# Altium schematic sheet Communication.SchDoc: Communication.SchDoc
size A4; Author: Daniel Sinko; Revision: A; SheetNumber: 4; SheetTotal: 5
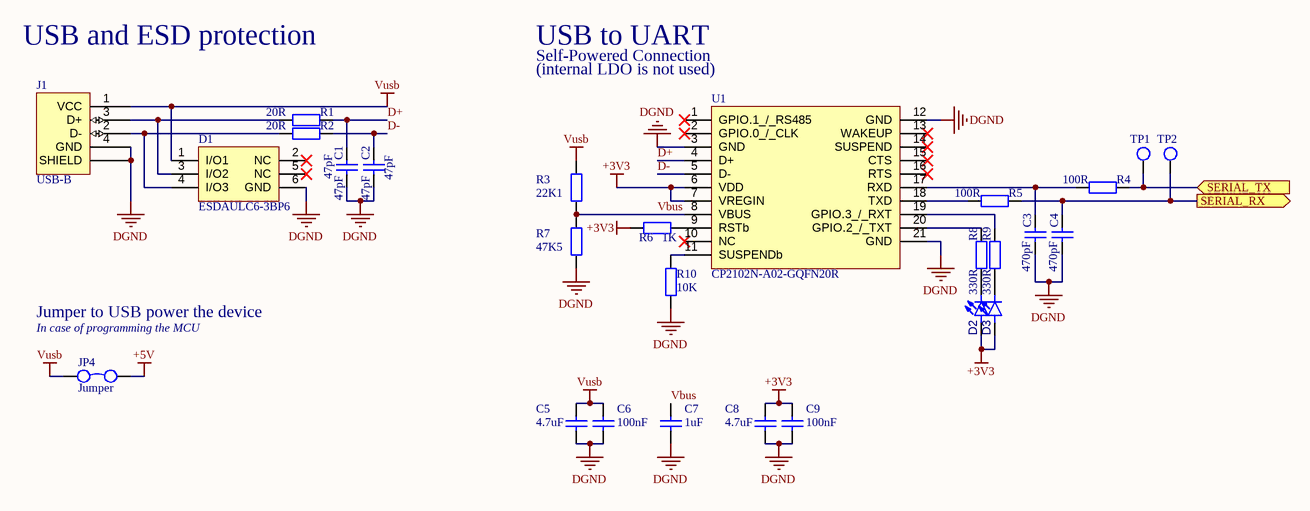
[diagram p0: Communication.SchDoc]

## Parts
C1  47pF  [CAP0603]
C2  47pF  [CAP0603]
C3  470pF  [CAP0603]
C4  470pF  [CAP0603]
C5  4.7uF  [CAP0603]
C6  100nF  [CAP0603]
C7  1uF  [CAP0603]
C8  4.7uF  [CAP0603]
C9  100nF  [CAP0603]
D1  ESDAULC6-3BP6  [SOT-666]
D2  (no value)  [LED0603]
D3  (no value)  [LED0603]
J1  USB-B  [USB-B-FEMALE]
JP4  Jumper  [PIN-1X2]
R1  20R  [RES0603]
R2  20R  [RES0603]
R3  22K1  [RES0603]
R4  100R  [RES0603]
R5  100R  [RES0603]
R6  1K  [RES0603]
R7  47K5  [RES0603]
R8  330R  [RES0603]
R9  330R  [RES0603]
R10  10K  [RES0603]
TP1  Test Point  [TP-1.5HOLE]  (value not drawn)
TP2  Test Point  [TP-1.5HOLE]  (value not drawn)
U1  CP2102N-A02-GQFN20R  [QFN-20]

## Ports
SERIAL_RX (out, see Main[4C], uC[1B]), SERIAL_TX (in, see Main[4C], uC[1B])

## Nets
+3V3: C8.2 C9.1 D2.2(A) D3.2(A) R6.1 U1.6(VDD) U1.7(VREGIN)
+5V: JP4.2
DGND: C1.1 C2.1 C3.1 C4.1 C5.1 C6.2 C7.1 C8.1 C9.2 D1.6(GND) J1.0(SHIELD) J1.4(GND) R7.1 R10.1 U1.3(GND) U1.12(GND) U1.21(GND)
Vusb: C5.2 C6.1 D1.1(I/O1) J1.1(VCC) JP4.1 R3.2
D+: C1.2 R1.1 U1.4(D+)
D-: C2.2 R2.1 U1.5(D-)
SERIAL_RX: C4.2 R5.2 TP2.1 ; port SERIAL_RX
SERIAL_TX: R4.2 TP1.1 ; port SERIAL_TX
Vbus: C7.2 R3.1 R7.2 U1.8(VBUS)
NetC3_2: C3.2 R4.1 U1.17(RXD)
NetD1_3: D1.3(I/O2) J1.3(D+) R1.2
NetD1_4: D1.4(I/O3) J1.2(D-) R2.2
NetD2_1: D2.1(K) R8.2
NetD3_1: D3.1(K) R9.2
NetR5_1: R5.1 U1.18(TXD)
NetR6_2: R6.2 U1.9(RSTb)
NetR8_1: R8.1 U1.20(GPIO.2_/_TXT)
NetR9_1: R9.1 U1.19(GPIO.3_/_RXT)
NetR10_2: R10.2 U1.11(SUSPENDb)

Not connected (* = marked no-connect by the designer): D1 2(NC)* 5(NC)*; U1 1(GPIO.1_/_RS485)* 2(GPIO.0_/_CLK)* 10(NC)* 13(WAKEUP)* 14(SUSPEND)* 15(CTS)* 16(RTS)*

## Notes on the sheet
- USB and ESD protection
- USB to UART
- Self-Powered Connection
- (near U1) (internal LDO is not used)
- Jumper to USB power the device
- (near JP4) In case of programming the MCU
- Size
- Date
- A4
- Title
- Sheet number
- Author
- Revision

## Library data of the parts
C1 C2 = 47pF: Ceramic Capacitor, Multilayer, Ceramic, 100V, 5% +Tol, 5% -Tol, C0G, 30ppm/Cel TC, 0.000047uF, Surface Mount, 0603; Manufacturer: KEMET; Manufacturer Part Number: C0603C470J1GACTU; Multilayer: Yes; Voltage: *; Supplier: Mouser; Supplier Part Number: 80-C0603C470J1G; RoHS: Yes; Category: Ceramic Capacitors; Stock: 43381; Pricing: 1=0.1, 10=0.026, 50=0.026, 100=0.016, 1000=0.012, 10000=0.007 (USD); Mounting Technology: Surface Mount; Pins: 2; Dielectric Material: Ceramic; Package Shape: Rectangular; Case/Package: 0603; Terminal Finish: Nickel; Min Operating Temperature: -55°C; Max Operating Temperature: 125°C; JESD-609 Code: e3; Capacitor Type: Ceramic; Tolerance  (fill in as +-): 5%; Package Style: SMTMeter; Packaging: Tape and Reel; Tolerance (fill in as +-): 5%; Rated DC Voltage (URdc): 100V; Temperature Characteristics Code: C0G; Termination: Wraparound; Length: 1.6mm; Width: 0.8mm; Height: 0.8mm; Reach SVHC Compliant: Yes; RoHS Compliant: Yes; ComponentLink1URL: https://datasheet.ciiva.com:443/pdfs/VipMasterIC/IC/KEME/KEME-S-A0005605168/KEME-S-A0005605168-1.pdf?src-supplier=IHS+Markit; ComponentLink1Description: https://datasheet.ciiva.com:443/pdfs/VipMasterIC/IC/KEME/KEME-S-A0005605168/KEME-S-A0005605168-1.pdf?src-supplier=IHS+Markit; ComponentLink2URL: https://datasheet.ciiva.com/28668/1789732-28668693.pdf?src-supplier=Element14; ComponentLink2Description: https://datasheet.ciiva.com/28668/1789732-28668693.pdf?src-supplier=Element14; ComponentLink3URL: https://datasheet.ciiva.com/18193/getdatasheetpartid-544691-18193046.pdf?src-supplier=Verical; ComponentLink3Description: https://datasheet.ciiva.com/18193/getdatasheetpartid-544691-18193046.pdf?src-supplier=Verical; ComponentLink4URL: https://datasheet.ciiva.com/18101/getdatasheetpartid-38001-18101098.pdf?src-supplier=Verical; ComponentLink4Description: https://datasheet.ciiva.com/18101/getdatasheetpartid-38001-18101098.pdf?src-supplier=Verical; Value: 47pF
C3 C4 = 470pF: Ceramic Capacitor, Multilayer, Ceramic, 250V, 5% +Tol, 5% -Tol, C0G, 30ppm/Cel TC, 0.00047uF, Surface Mount, 0603; Manufacturer: KEMET; Manufacturer Part Number: C0603C471JAGACAUTO; Multilayer: Yes; Reference Standard: AEC-Q200; Supplier: Mouser; Supplier Part Number: 80-C0603C471JAGAUTO; RoHS: Yes; Category: Ceramic Capacitors; Stock: 51887; Pricing: 1=0.1, 10=0.068, 50=0.068, 100=0.034, 1000=0.022, 10000=0.017 (USD); Pins: 2; Dielectric Material: Ceramic; Case/Package: 0603; Terminal Finish: Nickel; Min Operating Temperature: -55°C; Max Operating Temperature: 125°C; JESD-609 Code: e3; Capacitor Type: Ceramic; Tolerance  (fill in as +-): 5%; Package Style: SMTMeter; Packaging: Tape and Reel; Tolerance (fill in as +-): 5%; Rated DC Voltage (URdc): 250V; Temperature Characteristics Code: C0G; Length: 1.6mm; Width: 0.8mm; Height: 0.8mm; Reach SVHC Compliant: Yes; RoHS Compliant: Yes; ComponentLink1URL: https://datasheet.ciiva.com:443/pdfs/VipMasterIC/IC/KEME/KEME-S-A0008958445/KEME-S-A0008958445-1.pdf?src-supplier=IHS+Markit; ComponentLink1Description: https://datasheet.ciiva.com:443/pdfs/VipMasterIC/IC/KEME/KEME-S-A0008958445/KEME-S-A0008958445-1.pdf?src-supplier=IHS+Markit; ComponentLink2URL: http://www.mouser.com/ds/2/212/KEM_C1086_U2J-962528.pdf?src-supplier=Mouser; ComponentLink2Description: http://www.mouser.com/ds/2/212/KEM_C1086_U2J-962528.pdf?src-supplier=Mouser; ComponentLink3URL: http://www.kemet.com/Lists/ProductCatalog/Attachments/420/KEM_C1022_C0G_AUTO_SMD.pdf?src-supplier=Digikey; ComponentLink3Description: http://www.kemet.com/Lists/ProductCatalog/Attachments/420/KEM_C1022_C0G_AUTO_SMD.pdf?src-supplier=Digikey; ComponentLink4URL: https://api.kemet.com/component-edge/download/datasheet/C0603C471JAGACAUTO.pdf?src-supplier=Digikey; ComponentLink4Description: https://api.kemet.com/component-edge/download/datasheet/C0603C471JAGACAUTO.pdf?src-supplier=Digikey; Value: 470pF
C5 C8 = 4.7uF: Capacitor Ceramic 4.7uF 10V X5R 10% 0603 T/R; Manufacturer: Samsung; Manufacturer Part Number: CL10A475KP8NNWC; Voltage: *; Value: 4.7uF; Supplier: Mouser; Supplier Part Number: 187-CL10A475KP8NNWC; RoHS: No; Category: Ceramic Capacitors; Stock: 20365; Pricing: 1=0.1, 10=0.024, 50=0.024, 100=0.021, 1000=0.012, 10000=0.009 (USD)
C6 C9 = 100nF: Ceramic Capacitor, Multilayer, Ceramic, 25V, 10% +Tol, 10% -Tol, X7R, 15% TC, 0.1uF, Surface Mount, 0603; Manufacturer: Samsung; Manufacturer Part Number: CL10B104KA8WPNC; Multilayer: Yes; Reference Standard: AEC-Q200; Voltage: *; Value: 100nF; Supplier: Mouser; Supplier Part Number: 187-CL10B104KA8WPNC; RoHS: Yes; Category: Ceramic Capacitors; Stock: 62899; Pricing: 1=0.1, 10=0.026, 50=0.026, 100=0.018, 1000=0.014, 10000=0.009 (USD); Mounting Technology: Surface Mount; Pins: 2; Dielectric Material: Ceramic; Package Shape: Rectangular; Case/Package: 0603; Terminal Finish: Nickel; Min Operating Temperature: -55°C; Max Operating Temperature: 125°C; JESD-609 Code: e3; Capacitor Type: Ceramic; Tolerance  (fill in as +-): 10%; Packaging: Tape and Reel; Tolerance (fill in as +-): 10%; Rated DC Voltage (URdc): 25V; Temperature Characteristics Code: X7R; Termination: Wraparound; Reach SVHC Compliant: Yes; RoHS Compliant: Yes; ComponentLink1URL: https://datasheet.ciiva.com:443/pdfs/VipMasterIC/IC/SEMS/SEMS-S-A0005596039/SEMS-S-A0005592818-1.pdf?src-supplier=IHS+Markit; ComponentLink1Description: https://datasheet.ciiva.com:443/pdfs/VipMasterIC/IC/SEMS/SEMS-S-A0005596039/SEMS-S-A0005592818-1.pdf?src-supplier=IHS+Markit; ComponentLink2URL: http://www.samsungsem.com/kr/support/library/product-catalog/mlcc.jsp?src-supplier=Digikey; ComponentLink2Description: http://www.samsungsem.com/kr/support/library/product-catalog/mlcc.jsp?src-supplier=Digikey; ComponentLink3URL: http://www.samsungsem.com/kr/support/product-search/mlcc/CL10B104KA8WPNC.jsp?src-supplier=Digikey; ComponentLink3Description: http://www.samsungsem.com/kr/support/product-search/mlcc/CL10B104KA8WPNC.jsp?src-supplier=Digikey; ComponentLink4URL: http://www.samsungsem.com/servlet/FileDownload?filename=productcatalog/pdf/MLCC.pdf&src-supplier=Avnet; ComponentLink4Description: http://www.samsungsem.com/servlet/FileDownload?filename=productcatalog/pdf/MLCC.pdf&src-supplier=Avnet; ComponentLink5URL: https://datasheet.octopart.com/CL10B104KA8WPNC-Samsung-Electro-Mechanics-datasheet-148763375.pdf?src-supplier=Future+Electronics; ComponentLink5Description: https://datasheet.octopart.com/CL10B104KA8WPNC-Samsung-Electro-Mechanics-datasheet-148763375.pdf?src-supplier=Future+Electronics; ComponentLink6URL: https://datasheet.octopart.com/CL10B104KA8WPNC-Samsung-datasheet-8326407.pdf?src-supplier=TME; ComponentLink6Description: https://datasheet.octopart.com/CL10B104KA8WPNC-Samsung-datasheet-8326407.pdf?src-supplier=TME
C7 = 1uF: Ceramic Capacitor, Multilayer, Ceramic, 16V, 10% +Tol, 10% -Tol, X7R, 15% TC, 1uF, Surface Mount, 0603; Manufacturer: Walsin Technologies; Manufacturer Part Number: SH18B105K160CT; Voltage: *; Value: 1uF; Supplier: Mouser; Supplier Part Number: 791-SH18B105K160CT; RoHS: Yes; Category: Ceramic Capacitors; Stock: 5174; Pricing: 1=0.1, 10=0.04, 50=0.04, 100=0.023, 1000=0.015, 10000=0.01 (USD); ComponentLink1URL: https://datasheet.octopart.com/SH18B105K160CT-Walsin-Technologies-datasheet-149178370.pdf?src-supplier=TECHDesign; ComponentLink1Description: https://datasheet.octopart.com/SH18B105K160CT-Walsin-Technologies-datasheet-149178370.pdf?src-supplier=TECHDesign
D1 = ESDAULC6-3BP6: Trans Voltage Suppressor Diode, Bidirectional, 4 Element, Silicon; Manufacturer_Name: STMicroelectronics; Package Body Material: Plastic; Max Breakdown Voltage: 9.2V; Min Breakdown Voltage: 6V; Breakdown Voltage-Nom: 7.6V; Number of Elements: 4; Time @ Peak Reflow Temperature-Max (s): 30s; Qualification Status: Not Qualified; Datasheet Link: https://www.st.com/resource/en/datasheet/esdaulc6-3bp6.pdf; Height: 0.6mm; Manufacturer_Part_Number: ESDAULC6-3BP6; Mouser Part Number: 511-ESDAULC63BP6; Mouser Price/Stock: https://www.mouser.co.uk/ProductDetail/STMicroelectronics/ESDAULC6-3BP6?qs=eU2TTeT5rM3P6hIT2KJeMw%3D%3D; Arrow Part Number: ESDAULC6-3BP6; Arrow Price/Stock: https://www.arrow.com/en/products/esdaulc6-3bp6/stmicroelectronics?region=europe; Supplier: Mouser; Supplier Part Number: 511-ESDAULC63BP6; Manufacturer: STMicroelectronics; Manufacturer Part Number: ESDAULC6-3BP6; RoHS: Yes; Category: TVS Diodes; Stock: 6079; Pricing: 1=0.46, 10=0.312, 50=0.312, 100=0.211, 1000=0.146, 10000=0.103 (USD); Pins: 6; Diode Element Material: SILICON; Package Shape: Rectangular; Terminal Finish: Tin; Max Operating Temperature: 150°C; JESD-609 Code: e3; Polarity: Bidirectional; Diode Type: TRANS VOLTAGE SUPPRESSOR; JESD-30 Code: R-PDSO-F6; Moisture Sensitivity Level: 1; Package Style: SMALL OUTLINEMeter; Peak Reflow Temperature (Cel): 260°C; Surface Mount: Yes; Technology: AVALANCHE; Terminal Form: Flat; Terminal Position: DUAL; Reach SVHC Compliant: Yes; RoHS Compliant: Yes; ComponentLink1URL: https://datasheet.ciiva.com:443/pdfs/VipMasterIC/IC/SGST/SGSTS28710/SGSTS28710-1.pdf?src-supplier=IHS+Markit; ComponentLink1Description: https://datasheet.ciiva.com:443/pdfs/VipMasterIC/IC/SGST/SGSTS28710/SGSTS28710-1.pdf?src-supplier=IHS+Markit; ComponentLink2URL: https://datasheet.ciiva.com/16216/cd00165276-16216912.pdf?src-supplier=Future+Electronics; ComponentLink2Description: https://datasheet.ciiva.com/16216/cd00165276-16216912.pdf?src-supplier=Future+Electronics; ComponentLink3URL: https://datasheet.ciiva.com/15134/getdatasheetpartid-141575-15134300.pdf?src-supplier=Verical; ComponentLink3Description: https://datasheet.ciiva.com/15134/getdatasheetpartid-141575-15134300.pdf?src-supplier=Verical; ComponentLink4URL: https://datasheet.ciiva.com/342/cd00165276-342350.pdf?src-supplier=Digikey; ComponentLink4Description: https://datasheet.ciiva.com/342/cd00165276-342350.pdf?src-supplier=Digikey; ComponentLink5URL: https://datasheet.ciiva.com/342/cd00165276-342351.pdf?src-supplier=Digikey; ComponentLink5Description: https://datasheet.ciiva.com/342/cd00165276-342351.pdf?src-supplier=Digikey; ComponentLink6URL: https://datasheet.ciiva.com/342/cd00165276-342352.pdf?src-supplier=Digikey; ComponentLink6Description: https://datasheet.ciiva.com/342/cd00165276-342352.pdf?src-supplier=Digikey; ComponentLink7URL: https://datasheet.ciiva.com/4510/cd00165276-4510431.pdf?src-supplier=Mouser; ComponentLink7Description: https://datasheet.ciiva.com/4510/cd00165276-4510431.pdf?src-supplier=Mouser
D2 D3 = LED Green: Single Color LED, Bright Green, Water Clear, 1.1mm; Manufacturer: Wurth Electronics; Manufacturer Part Number: 150060VS75000; Shape: Rectangular; Forward Current: 30mA; Luminous Intensity-Nom: 40mcd; Channels: 1; Viewing Angle: 140°; Overall Height: 0.7mm; Supplier: Mouser; Supplier Part Number: 710-150060VS75000; RoHS: Yes; Category: LEDs; Stock: 96633; Pricing: 1=0.15, 10=0.15, 50=0.142, 100=0.122, 1000=0.116, 10000=0.116 (USD); Mounting Technology: Surface Mount; Pins: 2; Color: Green; Min Operating Temperature: -40°C; Max Operating Temperature: 85°C; Lens Style: WATER CLEAR; Optoelectronic Device Type: SINGLE COLOR LED; Packaging: Tape and Reel; Size: 1.1mm; Terminal Pitch: 1.6mm; Reach SVHC Compliant: Yes; RoHS Compliant: Yes; ComponentLink1URL: https://datasheet.ciiva.com:443/pdfs/VipMasterIC/IC/MIDC/MIDC-S-A0007768636/MIDC-S-A0007768636-1.pdf?src-supplier=IHS+Markit; ComponentLink1Description: https://datasheet.ciiva.com:443/pdfs/VipMasterIC/IC/MIDC/MIDC-S-A0007768636/MIDC-S-A0007768636-1.pdf?src-supplier=IHS+Markit; ComponentLink2URL: https://datasheet.ciiva.com/29562/150060vs75000-29562919.pdf?src-supplier=Digikey; ComponentLink2Description: https://datasheet.ciiva.com/29562/150060vs75000-29562919.pdf?src-supplier=Digikey
J1 = USB-B: USB Connector, 4 Contact(s), Female, Right Angle, Solder Terminal, Receptacle; Manufacturer: CUI Devices; Manufacturer Part Number: UJ2-BH-W2-TH; Supplier: Mouser; Supplier Part Number: 490-UJ2-BH-W2-TH; RoHS: No; Category: USB Connectors; Stock: 1415; Pricing: 1=0.37, 10=0.365, 50=0.365, 100=0.31, 1000=0.309, 10000=0.309 (USD); ComponentLink1URL: https://www.cuidevices.com/product/resource/digikeypdf/uj2-bh-th.pdf?src-supplier=Digikey; ComponentLink1Description: https://www.cuidevices.com/product/resource/digikeypdf/uj2-bh-th.pdf?src-supplier=Digikey; ComponentLink2URL: https://datasheet.octopart.com/UJ2-BH-W2-TH-CUI-Devices-datasheet-142372266.pdf?src-supplier=Future+Electronics; ComponentLink2Description: https://datasheet.octopart.com/UJ2-BH-W2-TH-CUI-Devices-datasheet-142372266.pdf?src-supplier=Future+Electronics; ComponentLink3URL: https://datasheet.octopart.com/UJ2-BH-W2-TH-CUI-Devices-datasheet-103114882.pdf?src-supplier=Master+Electronics; ComponentLink3Description: https://datasheet.octopart.com/UJ2-BH-W2-TH-CUI-Devices-datasheet-103114882.pdf?src-supplier=Master+Electronics
JP4 = Jumper: Interconnection Device; Manufacturer: Harwin; Manufacturer Part Number: M7582-46; Manufacturer Series: M75; Additional Feature: ROHS COMPLIANT; Body/Shell Style: PLUG; Contact Pattern: RECTANGULAR; Contact Resistance: 20mR; Contact Style: SQ PIN-SKT; Dielectric Withstanding Voltage (AC): 500V; Insertion Force-Max: 6.672N; Insulation Resistance: 5GR; Number Of Connectors: 1; Rated Current (Signal): 1A; Number of Contacts: 2; Body Breadth: 0.094inch; Body Depth: 0.236inch; Body Length: 0.197inch; Mating Contact Pitch: 0.1inch; Reference Standard: UL; Reliability: COMMERCIAL; Supplier: Mouser; Supplier Part Number: 855-M7582-46; RoHS: Yes; Category: Uncategorized; Stock: 4991; Pricing: 1=0.19, 10=0.125, 50=0.125, 100=0.104, 1000=0.075, 10000=0.072 (USD); Contact Material: Bronze; Contact Finish - Mating: SN; Contact Finish - Termination: Tin (Sn); Insulation Color: Black; Insulation Material: Glass; Min Operating Temperature: -55°C; Max Operating Temperature: 105°C; Connector Type: Interconnection Device; JESD-609 Code: e3; Contact Gender: Female; Mounting Style: STRAIGHT; Number of Rows Loaded: 1; Reach SVHC Compliant: Yes; RoHS Compliant: Yes; ComponentLink1URL: https://datasheet.ciiva.com:443/pdfs/VipMasterIC/IC/HRWN/HRWNS06295/HRWNS06295-1.pdf?src-supplier=IHS+Markit; ComponentLink1Description: https://datasheet.ciiva.com:443/pdfs/VipMasterIC/IC/HRWN/HRWNS06295/HRWNS06295-1.pdf?src-supplier=IHS+Markit; ComponentLink2URL: http://www.mouser.com/ds/2/181/M7580-M7583-351524.pdf?src-supplier=Mouser; ComponentLink2Description: http://www.mouser.com/ds/2/181/M7580-M7583-351524.pdf?src-supplier=Mouser; ComponentLink3URL: https://cdn.harwin.com/pdfs/Harwin_PC_Connectors_M20.pdf?src-supplier=Digikey; ComponentLink3Description: https://cdn.harwin.com/pdfs/Harwin_PC_Connectors_M20.pdf?src-supplier=Digikey; ComponentLink4URL: http://www.harwin.com/include/downloads/pdfs/2010PAGE125.PDF?src-supplier=Avnet; ComponentLink4Description: http://www.harwin.com/include/downloads/pdfs/2010PAGE125.PDF?src-supplier=Avnet
R1 R2 = 20R: Fixed Resistor, Metal Glaze/thick Film, 0.1W, 20ohm, 75V, 1% +/-Tol, 100ppm/Cel, Surface Mount, 0603; Manufacturer: Vishay; Manufacturer Part Number: CRCW060320R0FKEA; Temperature Coefficient: 100ppm/°C; Rated Temperature: 70°C; Package Height: 0.45mm; Package Length: 1.55mm; Package Width: 0.85mm; Reference Standard: AEC-Q200; Value: 20R; Supplier Part Number: 71-CRCW0603-20-E3; RoHS: Yes; Category: Chip SMD Resistors; Stock: 239322; Pricing: 1=0.1, 10=0.014, 50=0.014, 100=0.01, 1000=0.008, 10000=0.004 (USD); Mounting Technology: Surface Mount; Pins: 2; Case/Package: 0603; Terminal Finish: Nickel; Package Shape: Rectangular; Min Operating Temperature: -55°C; Max Operating Temperature: 155°C; JESD-609 Code: e3; Resistor Type: FIXED RESISTOR; Construction: Chip; Packaging: Tape and Reel; Technology: METAL GLAZE/THICK FILM; Working Voltage: 75V; Termination: Wraparound; Reach SVHC Compliant: Yes; RoHS Compliant: Yes; ComponentLink1URL: https://datasheet.ciiva.com:443/pdfs/VipMasterIC/IC/VISH/VISH-S-A0007266705/VISH-S-A0007266705-1.pdf?src-supplier=IHS+Markit; ComponentLink1Description: https://datasheet.ciiva.com:443/pdfs/VipMasterIC/IC/VISH/VISH-S-A0007266705/VISH-S-A0007266705-1.pdf?src-supplier=IHS+Markit; ComponentLink2URL: https://datasheet.ciiva.com/11810/0900766b80d98afc-11810778.pdf?src-supplier=Rs; ComponentLink2Description: https://datasheet.ciiva.com/11810/0900766b80d98afc-11810778.pdf?src-supplier=Rs; ComponentLink3URL: https://datasheet.ciiva.com/26316/fld-crcw-e3-data-en-26316589.pdf?src-supplier=Distrelec; ComponentLink3Description: https://datasheet.ciiva.com/26316/fld-crcw-e3-data-en-26316589.pdf?src-supplier=Distrelec; ComponentLink4URL: https://datasheet.ciiva.com/16776/70201119-16776202.pdf?src-supplier=Allied+Electronics; ComponentLink4Description: https://datasheet.ciiva.com/16776/70201119-16776202.pdf?src-supplier=Allied+Electronics; ComponentLink5URL: https://datasheet.ciiva.com/16788/70201119-16788011.pdf?src-supplier=Allied+Electronics; ComponentLink5Description: https://datasheet.ciiva.com/16788/70201119-16788011.pdf?src-supplier=Allied+Electronics; ComponentLink6URL: https://datasheet.ciiva.com/3257/dcrcwe3-3257244.pdf?src-supplier=Avnet; ComponentLink6Description: https://datasheet.ciiva.com/3257/dcrcwe3-3257244.pdf?src-supplier=Avnet; ComponentLink7URL: https://datasheet.ciiva.com/16374/dcrcwe3-16374634.pdf?src-supplier=Future+Electronics; ComponentLink7Description: https://datasheet.ciiva.com/16374/dcrcwe3-16374634.pdf?src-supplier=Future+Electronics; ComponentLink8URL: https://datasheet.ciiva.com/7748/1533075-7748858.pdf?src-supplier=Element14; ComponentLink8Description: https://datasheet.ciiva.com/7748/1533075-7748858.pdf?src-supplier=Element14; ComponentLink9URL: https://datasheet.ciiva.com/2465/dcrcwe3-2465673.pdf?src-supplier=Digikey; ComponentLink9Description: https://datasheet.ciiva.com/2465/dcrcwe3-2465673.pdf?src-supplier=Digikey; ComponentLink10URL: https://datasheet.ciiva.com/2465/dcrcwe3-2465674.pdf?src-supplier=Digikey; ComponentLink10Description: https://datasheet.ciiva.com/2465/dcrcwe3-2465674.pdf?src-supplier=Digikey; ComponentLink11URL: https://datasheet.ciiva.com/2465/dcrcwe3-2465672.pdf?src-supplier=Digikey; ComponentLink11Description: https://datasheet.ciiva.com/2465/dcrcwe3-2465672.pdf?src-supplier=Digikey; ComponentLink12URL: https://datasheet.ciiva.com/5548/dcrcwe3-109170-5548022.pdf?src-supplier=Mouser; ComponentLink12Description: https://datasheet.ciiva.com/5548/dcrcwe3-109170-5548022.pdf?src-supplier=Mouser; ComponentLink13URL: https://datasheet.ciiva.com/3257/dcrcwe3-3257243.pdf?src-supplier=Avnet; ComponentLink13Description: https://datasheet.ciiva.com/3257/dcrcwe3-3257243.pdf?src-supplier=Avnet
R3 = 22K1: 22.1K F 1/16 0603; Manufacturer: Mitsubishi Kamaya; Manufacturer Part Number: RMC1/16K2212FTP; Value: 22K1; Supplier Part Number: 791-RMC1/16K2212FTP; RoHS: No; Stock: 67571; Pricing: 1=0.1, 10=0.011, 50=0.011, 100=0.005, 1000=0.002, 10000=0.001 (USD)
R4 R5 = 100R: Fixed Resistor, Metal Glaze/thick Film, 0.1W, 100ohm, 75V, 5% +/-Tol, 100ppm/Cel, Surface Mount, 0603; Manufacturer: Yageo; Manufacturer Part Number: RC0603JR-13100RL; Additional Feature: LASER TRIMMABLE; Rated Temperature: 70°C; Temperature Coefficient: 100ppm/°C; Package Height: 0.45mm; Package Length: 1.6mm; Package Width: 0.8mm; Value: 100R; Supplier Part Number: 603-RC0603JR-13100RL; RoHS: Yes; Category: Chip SMD Resistors; Stock: 92782; Pricing: 1=0.1, 10=0.01, 50=0.01, 100=0.006, 1000=0.005, 10000=0.003 (USD); Mounting Technology: Surface Mount; Pins: 2; Package Shape: Rectangular; Case/Package: 0603; Terminal Finish: Nickel; Min Operating Temperature: -55°C; Max Operating Temperature: 155°C; JESD-609 Code: e3; Resistor Type: FIXED RESISTOR; Construction: Chip; Packaging: Tape and Reel; Technology: METAL GLAZE/THICK FILM; Termination: Wraparound; Working Voltage: 75V; Reach SVHC Compliant: Yes; RoHS Compliant: Yes; ComponentLink1URL: https://datasheet.ciiva.com:443/pdfs/VipMasterIC/IC/YAGO/YAGO-S-A0008145938/YAGO-S-A0008145938-1.pdf?src-supplier=IHS+Markit; ComponentLink1Description: https://datasheet.ciiva.com:443/pdfs/VipMasterIC/IC/YAGO/YAGO-S-A0008145938/YAGO-S-A0008145938-1.pdf?src-supplier=IHS+Markit; ComponentLink2URL: https://datasheet.ciiva.com/12558/rc0603-272842-12558903.pdf?src-supplier=Mouser; ComponentLink2Description: https://datasheet.ciiva.com/12558/rc0603-272842-12558903.pdf?src-supplier=Mouser; ComponentLink3URL: https://datasheet.ciiva.com/7983/443971-7983750.pdf?src-supplier=Element14; ComponentLink3Description: https://datasheet.ciiva.com/7983/443971-7983750.pdf?src-supplier=Element14
R6 = 1K: Fixed Resistor, Metal Glaze/thick Film, 0.1W, 1000ohm, 75V, 1% +/-Tol, 100ppm/Cel, Surface Mount, 0603; Manufacturer: Bourns; Manufacturer Part Number: CR0603-FX-1001ELF; Rated Temperature: 70°C; Temperature Coefficient: 100ppm/°C; Working Voltage: 50V; Package Height: 0.45mm; Package Length: 1.6mm; Package Width: 0.8mm; Value: 1K; Supplier Part Number: 652-CR0603FX-1001ELF; RoHS: Yes; Category: Chip SMD Resistors; Stock: 320220; Pricing: 1=0.1, 10=0.009, 50=0.009, 100=0.005, 1000=0.004, 10000=0.002 (USD); Mounting Technology: Surface Mount; Pins: 2; Package Shape: Rectangular; Case/Package: 0603; Terminal Finish: Nickel; Min Operating Temperature: -55°C; Max Operating Temperature: 155°C; JESD-609 Code: e3; Termination: Wraparound; Resistor Type: FIXED RESISTOR; Construction: Chip; Packaging: Tape and Reel; Technology: RUTHENIUM OXIDE; Reach SVHC Compliant: Yes; RoHS Compliant: Yes; ComponentLink1URL: https://datasheet.ciiva.com:443/pdfs/VipMasterIC/IC/BOUR/BOUR-S-A0009069624/BOUR-S-A0009069624-1.pdf?src-supplier=IHS+Markit; ComponentLink1Description: https://datasheet.ciiva.com:443/pdfs/VipMasterIC/IC/BOUR/BOUR-S-A0009069624/BOUR-S-A0009069624-1.pdf?src-supplier=IHS+Markit; ComponentLink2URL: https://datasheet.ciiva.com/11808/0900766b80fcdb72-11808035.pdf?src-supplier=Rs; ComponentLink2Description: https://datasheet.ciiva.com/11808/0900766b80fcdb72-11808035.pdf?src-supplier=Rs; ComponentLink3URL: https://datasheet.ciiva.com/19466/774882-19466523.pdf?src-supplier=Jameco; ComponentLink3Description: https://datasheet.ciiva.com/19466/774882-19466523.pdf?src-supplier=Jameco; ComponentLink4URL: https://datasheet.ciiva.com/7001/1902866-7001622.pdf?src-supplier=Newark; ComponentLink4Description: https://datasheet.ciiva.com/7001/1902866-7001622.pdf?src-supplier=Newark; ComponentLink5URL: https://datasheet.ciiva.com/7986/691949-7986156.pdf?src-supplier=Element14; ComponentLink5Description: https://datasheet.ciiva.com/7986/691949-7986156.pdf?src-supplier=Element14; ComponentLink6URL: https://datasheet.ciiva.com/22693/1902866-22693205.pdf?src-supplier=Element14; ComponentLink6Description: https://datasheet.ciiva.com/22693/1902866-22693205.pdf?src-supplier=Element14; ComponentLink7URL: https://datasheet.ciiva.com/5546/chpreztr-5546283.pdf?src-supplier=Mouser; ComponentLink7Description: https://datasheet.ciiva.com/5546/chpreztr-5546283.pdf?src-supplier=Mouser; ComponentLink8URL: https://datasheet.ciiva.com/16757/70154685-16757482.pdf?src-supplier=Allied+Electronics; ComponentLink8Description: https://datasheet.ciiva.com/16757/70154685-16757482.pdf?src-supplier=Allied+Electronics; ComponentLink9URL: https://datasheet.ciiva.com/3255/chpreztr-3255917.pdf?src-supplier=Avnet; ComponentLink9Description: https://datasheet.ciiva.com/3255/chpreztr-3255917.pdf?src-supplier=Avnet; ComponentLink10URL: https://datasheet.ciiva.com/6547/chpreztr-6547350.pdf?src-supplier=Digikey; ComponentLink10Description: https://datasheet.ciiva.com/6547/chpreztr-6547350.pdf?src-supplier=Digikey; ComponentLink11URL: https://datasheet.ciiva.com/6547/chpreztr-6547351.pdf?src-supplier=Digikey; ComponentLink11Description: https://datasheet.ciiva.com/6547/chpreztr-6547351.pdf?src-supplier=Digikey; ComponentLink12URL: https://datasheet.ciiva.com/6547/chpreztr-6547349.pdf?src-supplier=Digikey; ComponentLink12Description: https://datasheet.ciiva.com/6547/chpreztr-6547349.pdf?src-supplier=Digikey; ComponentLink13URL: https://datasheet.ciiva.com/30115/159chpreztr-30115222.pdf?src-supplier=Onlinecomponents.com; ComponentLink13Description: https://datasheet.ciiva.com/30115/159chpreztr-30115222.pdf?src-supplier=Onlinecomponents.com
R7 = 47K5: Fixed Resistor, Metal Glaze/thick Film, 0.1W, 47500ohm, 75V, 1% +/-Tol, 100ppm/Cel, Surface Mount, 0603; Manufacturer: Yageo; Manufacturer Part Number: RC0603FR-0747K5L; Additional Feature: LASER TRIMMABLE; Rated Temperature: 70°C; Temperature Coefficient: 100ppm/°C; Package Height: 0.45mm; Package Length: 1.6mm; Package Width: 0.8mm; Value: 47K5; Supplier Part Number: 603-RC0603FR-0747K5L; RoHS: Yes; Category: Chip SMD Resistors; Stock: 313163; Pricing: 1=0.1, 10=0.011, 50=0.011, 100=0.007, 1000=0.005, 10000=0.002 (USD); Mounting Technology: Surface Mount; Pins: 2; Package Shape: Rectangular; Case/Package: 0603; Terminal Finish: Nickel; Min Operating Temperature: -55°C; Max Operating Temperature: 155°C; JESD-609 Code: e3; Resistor Type: FIXED RESISTOR; Construction: Chip; Packaging: Tape and Reel; Technology: METAL GLAZE/THICK FILM; Termination: Wraparound; Working Voltage: 75V; Reach SVHC Compliant: Yes; RoHS Compliant: Yes; ComponentLink1URL: https://datasheet.ciiva.com:443/pdfs/VipMasterIC/IC/YAGO/YAGO-S-A0008145938/YAGO-S-A0008145938-1.pdf?src-supplier=IHS+Markit; ComponentLink1Description: https://datasheet.ciiva.com:443/pdfs/VipMasterIC/IC/YAGO/YAGO-S-A0008145938/YAGO-S-A0008145938-1.pdf?src-supplier=IHS+Markit; ComponentLink2URL: https://datasheet.ciiva.com/11808/0900766b80f96399-11808343.pdf?src-supplier=Rs; ComponentLink2Description: https://datasheet.ciiva.com/11808/0900766b80f96399-11808343.pdf?src-supplier=Rs; ComponentLink3URL: https://datasheet.ciiva.com/2454/pyu-r-int-thick-7-2454789.pdf?src-supplier=Digikey; ComponentLink3Description: https://datasheet.ciiva.com/2454/pyu-r-int-thick-7-2454789.pdf?src-supplier=Digikey; ComponentLink4URL: https://datasheet.ciiva.com/2454/pyu-r-int-thick-7-2454790.pdf?src-supplier=Digikey; ComponentLink4Description: https://datasheet.ciiva.com/2454/pyu-r-int-thick-7-2454790.pdf?src-supplier=Digikey; ComponentLink5URL: https://datasheet.ciiva.com/2454/pyu-r-int-thick-7-2454791.pdf?src-supplier=Digikey; ComponentLink5Description: https://datasheet.ciiva.com/2454/pyu-r-int-thick-7-2454791.pdf?src-supplier=Digikey; ComponentLink6URL: https://datasheet.ciiva.com/12555/rc0603-272842-12555285.pdf?src-supplier=Mouser; ComponentLink6Description: https://datasheet.ciiva.com/12555/rc0603-272842-12555285.pdf?src-supplier=Mouser; ComponentLink7URL: https://datasheet.ciiva.com/15189/getdatasheetpartid-135115-15189741.pdf?src-supplier=Verical; ComponentLink7Description: https://datasheet.ciiva.com/15189/getdatasheetpartid-135115-15189741.pdf?src-supplier=Verical
R8 R9 = 330R: Fixed Resistor, Metal Glaze/thick Film, 0.1W, 330ohm, 75V, 1% +/-Tol, 100ppm/Cel, Surface Mount, 0603; Manufacturer: Walsin Technologies; Manufacturer Part Number: WR06X3300FTL; Rated Temperature: 70°C; Temperature Coefficient: 100ppm/°C; Working Voltage: 50V; Package Height: 0.45mm; Package Length: 1.6mm; Package Width: 0.8mm; Value: 330R; Supplier Part Number: 791-WR06X3300FTL; RoHS: Yes; Category: Chip SMD Resistors; Stock: 10415; Pricing: 1=0.1, 10=0.007, 50=0.007, 100=0.003, 1000=0.003, 10000=0.001 (USD); Mounting Technology: Surface Mount; Pins: 2; Package Shape: Rectangular; Case/Package: 0603; Terminal Finish: Nickel; Min Operating Temperature: -55°C; Max Operating Temperature: 155°C; JESD-609 Code: e3; Resistor Type: FIXED RESISTOR; Packaging: Tape and Reel; Termination: Wraparound; Construction: Chip; Technology: METAL GLAZE/THICK FILM; Reach SVHC Compliant: Yes; RoHS Compliant: Yes; ComponentLink1URL: https://datasheet.ciiva.com:443/pdfs/VipMasterIC/IC/WATC/WATC-S-A0005256878/WATC-S-A0005256878-1.pdf?src-supplier=IHS+Markit; ComponentLink1Description: https://datasheet.ciiva.com:443/pdfs/VipMasterIC/IC/WATC/WATC-S-A0005256878/WATC-S-A0005256878-1.pdf?src-supplier=IHS+Markit; ComponentLink2URL: http://www.farnell.com/datasheets/1960319.pdf?src-supplier=Farnell; ComponentLink2Description: http://www.farnell.com/datasheets/1960319.pdf?src-supplier=Farnell; ComponentLink3URL: https://datasheet.octopart.com/WR06X3300FTL-Walsin-Technologies-datasheet-48038251.pdf?src-supplier=Element14; ComponentLink3Description: https://datasheet.octopart.com/WR06X3300FTL-Walsin-Technologies-datasheet-48038251.pdf?src-supplier=Element14; ComponentLink4URL: https://www.verical.com/server-webapp/html/getDatasheet?partID=414704&src-supplier=Verical; ComponentLink4Description: https://www.verical.com/server-webapp/html/getDatasheet?partID=414704&src-supplier=Verical
R10 = 10K: Fixed Resistor, Metal Glaze/thick Film, 0.1W, 10000ohm, 75V, 1% +/-Tol, 100ppm/Cel, Surface Mount, 0603; Manufacturer: Bourns; Manufacturer Part Number: CR0603-FX-1002ELF; Rated Temperature: 70°C; Temperature Coefficient: 100ppm/°C; Working Voltage: 50V; Package Height: 0.45mm; Package Length: 1.6mm; Package Width: 0.8mm; Value: 10K; Supplier Part Number: 652-CR0603FX-1002ELF; RoHS: Yes; Category: Chip SMD Resistors; Stock: 335503; Pricing: 1=0.1, 10=0.009, 50=0.009, 100=0.005, 1000=0.004, 10000=0.002 (USD); Mounting Technology: Surface Mount; Pins: 2; Package Shape: Rectangular; Case/Package: 0603; Terminal Finish: Nickel; Min Operating Temperature: -55°C; Max Operating Temperature: 155°C; Termination: Wraparound; JESD-609 Code: e3; Resistor Type: FIXED RESISTOR; Construction: Chip; Packaging: Tape and Reel; Technology: RUTHENIUM OXIDE; Reach SVHC Compliant: Yes; RoHS Compliant: Yes; ComponentLink1URL: https://datasheet.ciiva.com:443/pdfs/VipMasterIC/IC/BOUR/BOUR-S-A0009069624/BOUR-S-A0009069624-1.pdf?src-supplier=IHS+Markit; ComponentLink1Description: https://datasheet.ciiva.com:443/pdfs/VipMasterIC/IC/BOUR/BOUR-S-A0009069624/BOUR-S-A0009069624-1.pdf?src-supplier=IHS+Markit; ComponentLink2URL: https://datasheet.ciiva.com/11808/0900766b80fcdb72-11808032.pdf?src-supplier=Rs; ComponentLink2Description: https://datasheet.ciiva.com/11808/0900766b80fcdb72-11808032.pdf?src-supplier=Rs; ComponentLink3URL: https://datasheet.ciiva.com/27049/774903-27049975.pdf?src-supplier=Jameco; ComponentLink3Description: https://datasheet.ciiva.com/27049/774903-27049975.pdf?src-supplier=Jameco; ComponentLink4URL: https://datasheet.ciiva.com/22644/1849498-22644171.pdf?src-supplier=Element14; ComponentLink4Description: https://datasheet.ciiva.com/22644/1849498-22644171.pdf?src-supplier=Element14; ComponentLink5URL: https://datasheet.ciiva.com/22693/1902866-22693206.pdf?src-supplier=Element14; ComponentLink5Description: https://datasheet.ciiva.com/22693/1902866-22693206.pdf?src-supplier=Element14; ComponentLink6URL: https://datasheet.ciiva.com/5548/chpreztr-5548911.pdf?src-supplier=Mouser; ComponentLink6Description: https://datasheet.ciiva.com/5548/chpreztr-5548911.pdf?src-supplier=Mouser; ComponentLink7URL: https://datasheet.ciiva.com/16757/70154685-16757483.pdf?src-supplier=Allied+Electronics; ComponentLink7Description: https://datasheet.ciiva.com/16757/70154685-16757483.pdf?src-supplier=Allied+Electronics; ComponentLink8URL: https://datasheet.ciiva.com/3255/chpreztr-3255918.pdf?src-supplier=Avnet; ComponentLink8Description: https://datasheet.ciiva.com/3255/chpreztr-3255918.pdf?src-supplier=Avnet; ComponentLink9URL: https://datasheet.ciiva.com/7001/1902866-7001623.pdf?src-supplier=Newark; ComponentLink9Description: https://datasheet.ciiva.com/7001/1902866-7001623.pdf?src-supplier=Newark
U1 = CP2102N-A02-GQFN20R: USB Bus Controller, CMOS; Manufacturer_Name: Silicon Labs; Datasheet Link: https://www.silabs.com/documents/public/data-sheets/cp2102n-datasheet.pdf; Height: 0.8mm; Manufacturer_Part_Number: CP2102N-A02-GQFN20R; Mouser Part Number: 634-CP2102NA02QFN20R; Mouser Price/Stock: https://www.mouser.co.uk/ProductDetail/Silicon-Labs/CP2102N-A02-GQFN20R?qs=u16ybLDytRbf2uwPkMBdUg%3D%3D; Arrow Part Number: CP2102N-A02-GQFN20R; Arrow Price/Stock: https://www.arrow.com/en/products/cp2102n-a02-gqfn20r/silicon-labs?utm_currency=USD&region=nac; Supplier: Mouser; Supplier Part Number: 634-CP2102NA02QFN20R; Manufacturer: Silicon Labs; Manufacturer Part Number: CP2102N-A02-GQFN20R; RoHS: Yes; Category: Interface ICs; Stock: 75912; Pricing: 1=3.75, 10=3.73, 50=3.61, 100=3.24, 1000=2.43, 10000=2.08 (USD); ComponentLink1URL: https://datasheet.ciiva.com:443/pdfs/VipMasterIC/IC/SILC/SILC-S-A0007770867/SILC-S-A0007770867-1.pdf?src-supplier=IHS+Markit; ComponentLink1Description: https://datasheet.ciiva.com:443/pdfs/VipMasterIC/IC/SILC/SILC-S-A0007770867/SILC-S-A0007770867-1.pdf?src-supplier=IHS+Markit; ComponentLink2URL: https://www.silabs.com/documents/public/data-sheets/cp2102n-datasheet.pdf?src-supplier=Digikey; ComponentLink2Description: https://www.silabs.com/documents/public/data-sheets/cp2102n-datasheet.pdf?src-supplier=Digikey; ComponentLink3URL: https://datasheet.octopart.com/CP2102N-A02-GQFN20R-Silicon-Labs-datasheet-138898368.pdf?src-supplier=SHENGYU+ELECTRONICS; ComponentLink3Description: https://datasheet.octopart.com/CP2102N-A02-GQFN20R-Silicon-Labs-datasheet-138898368.pdf?src-supplier=SHENGYU+ELECTRONICS